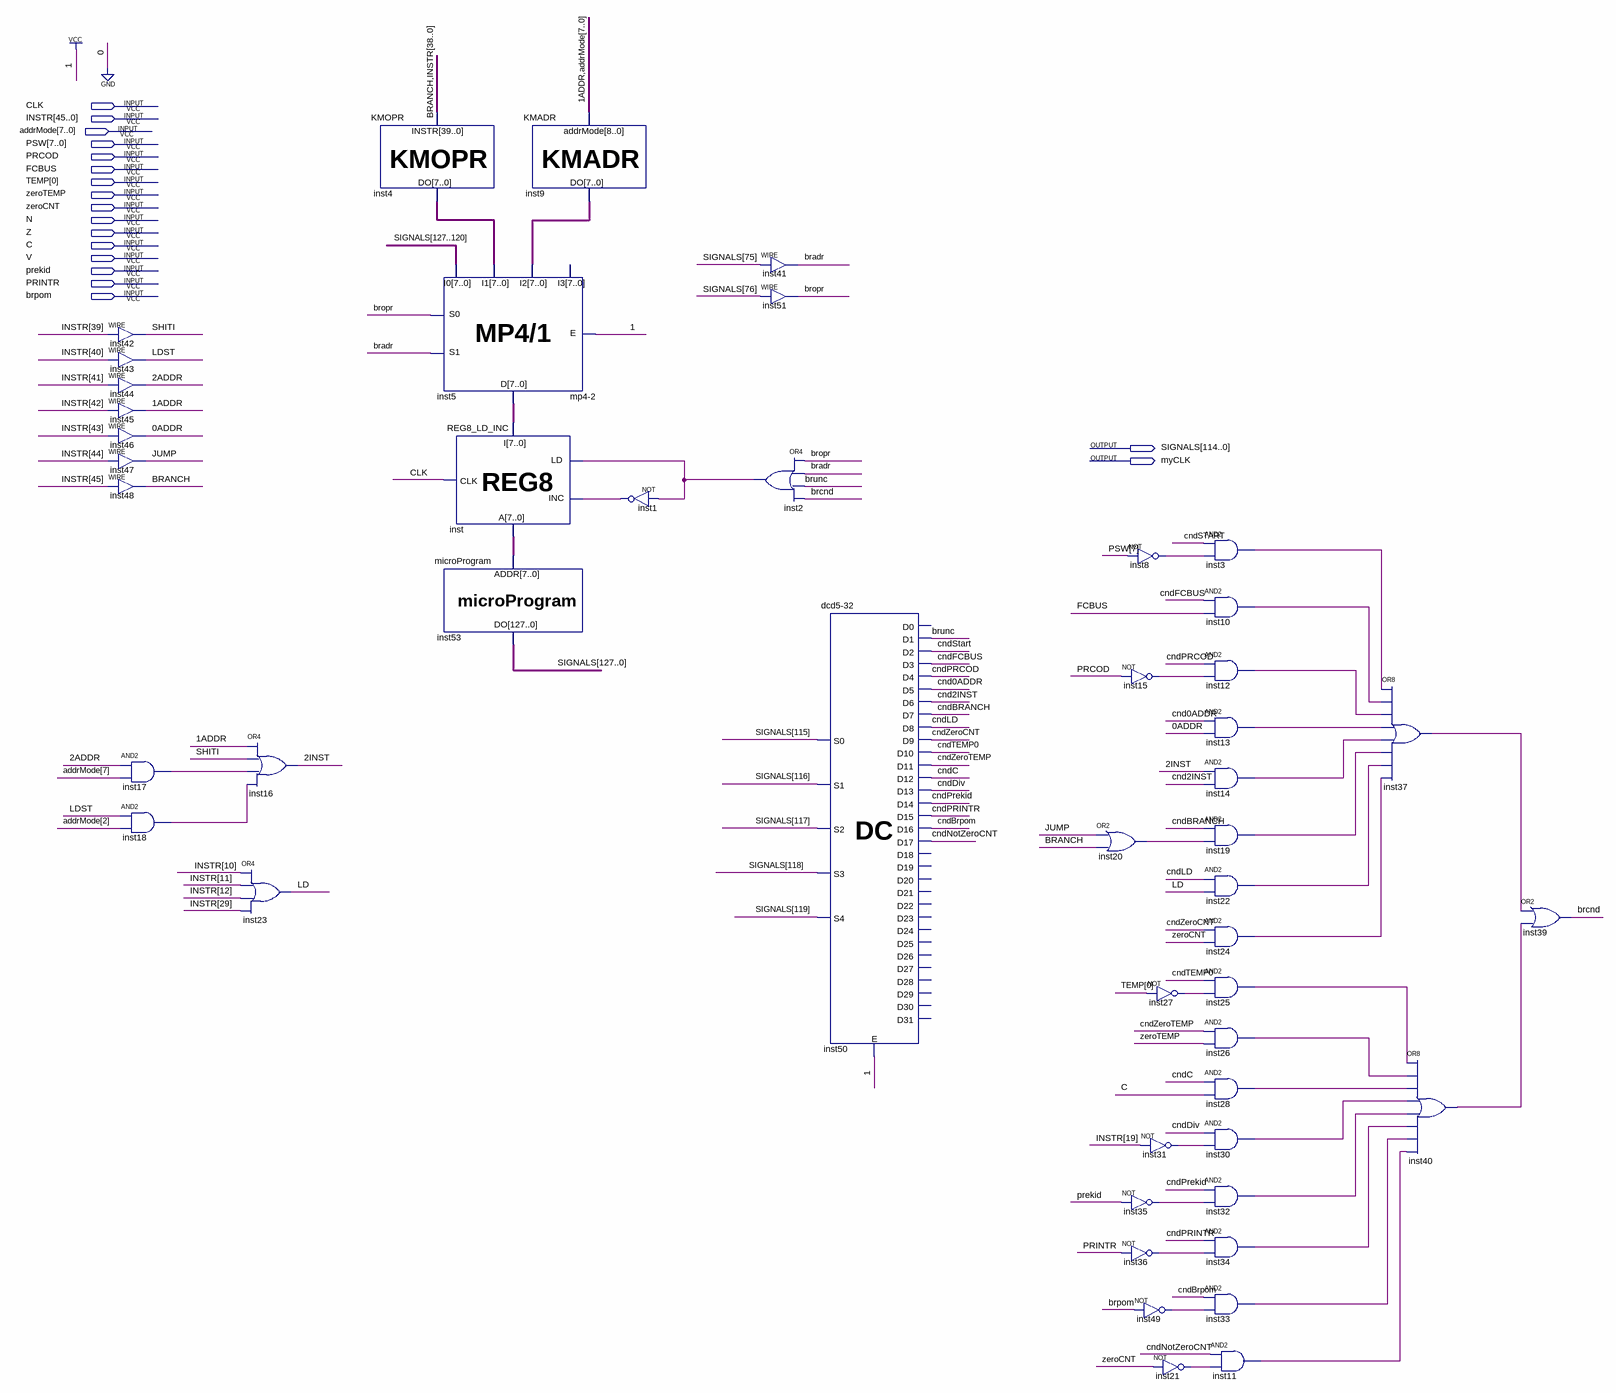
[diagram p0: schematic sheet]
// Quartus schematic Control_unit.bdf as structural Verilog: 49 symbols, 18 pins
module Control_unit (
  input  CLK,
  input  [45:0] INSTR,
  input  [7:0] addrMode,
  input  [7:0] PSW,
  input  PRCOD,
  input  FCBUS,
  input  [0:0] TEMP,
  input  zeroTEMP,
  input  zeroCNT,
  input  N,
  input  Z,
  input  C,
  input  V,
  input  prekid,
  input  PRINTR,
  input  brpom,
  output [127:0] SIGNALS,
  output myCLK
);

  wire \0ADDR , \1ADDR , \2ADDR , \2INST , bradr, BRANCH, brcnd, bropr, brunc, cnd0ADDR, cnd2INST, cndBRANCH,
       cndBrpom, cndC, cndDiv, cndFCBUS, cndLD, cndNotZeroCNT, cndPRCOD, cndPrekid, cndPRINTR, cndSTART,
       cndTEMP0, cndZeroCNT, cndZeroTEMP, inst1_out, inst2_out, inst3_out, inst8_out, inst10_out, inst11_out,
       inst12_out, inst13_out, inst14_out, inst15_out, inst17_out, inst18_out, inst19_out, inst20_out,
       inst21_out, inst22_out, inst24_out, inst25_out, inst26_out, inst27_out, inst28_out, inst30_out,
       inst31_out, inst32_out, inst33_out, inst34_out, inst35_out, inst36_out, inst37_out, inst40_out,
       inst49_out, JUMP, LD, LDST, SHITI;
  wire [7:0] inst4_do, inst5_d, inst9_do, inst_a;

  assign SHITI = INSTR[39];  // WIRE inst42
  assign LDST = INSTR[40];  // WIRE inst43
  assign \2ADDR  = INSTR[41];  // WIRE inst44
  assign \1ADDR  = INSTR[42];  // WIRE inst45
  assign \0ADDR  = INSTR[43];  // WIRE inst46
  assign JUMP = INSTR[44];  // WIRE inst47
  assign BRANCH = INSTR[45];  // WIRE inst48
  and inst17 (inst17_out, \2ADDR , addrMode[7]);
  and inst18 (inst18_out, LDST, addrMode[2]);
  or inst16 (\2INST , \1ADDR , SHITI, inst17_out, inst18_out);
  or inst23 (LD, INSTR[10], INSTR[11], INSTR[12], INSTR[29]);
  KMOPR inst4 (.INSTR({BRANCH, INSTR[38:0]}), .DO(inst4_do));
  \mp4-2  inst5 (
    .E(1'b1), .S0(bropr), .S1(bradr), .I0(SIGNALS[127:120]), .I1(inst4_do), .I2(inst9_do), .D(inst5_d));  // open: I3
  microProgram inst53 (.ADDR(inst_a), .DO(SIGNALS));
  REG8_LD_INC inst (.CLK(CLK), .I(inst5_d), .INC(inst1_out), .LD(inst2_out), .A(inst_a));
  KMADR inst9 (.addrMode({\1ADDR , addrMode}), .DO(inst9_do));
  not inst1 (inst1_out, inst2_out);
  assign bradr = SIGNALS[75];  // WIRE inst41
  assign bropr = SIGNALS[76];  // WIRE inst51
  or inst2 (inst2_out, bropr, bradr, brunc, brcnd);
  \dcd5-32  inst50 (
    .E(1'b1), .S0(SIGNALS[115]), .S1(SIGNALS[116]), .S2(SIGNALS[117]), .S3(SIGNALS[118]), .S4(SIGNALS[119]),
    .D1(brunc), .D2(cndSTART), .D3(cndFCBUS), .D4(cndPRCOD), .D5(cnd0ADDR), .D6(cnd2INST), .D7(cndBRANCH),
    .D8(cndLD), .D9(cndZeroCNT), .D10(cndTEMP0), .D11(cndZeroTEMP), .D12(cndC), .D13(cndDiv),
    .D14(cndPrekid), .D15(cndPRINTR), .D16(cndBrpom), .D17(cndNotZeroCNT));  // open: D0, D18, D19, D20, D21, D22, D23, D24, D25, D26, D27, D28, D29, D30, D31
  not inst8 (inst8_out, PSW[7]);
  not inst15 (inst15_out, PRCOD);
  or inst20 (inst20_out, JUMP, BRANCH);
  not inst31 (inst31_out, INSTR[19]);
  not inst35 (inst35_out, prekid);
  not inst36 (inst36_out, PRINTR);
  not inst49 (inst49_out, brpom);
  not inst27 (inst27_out, TEMP[0]);
  not inst21 (inst21_out, zeroCNT);
  and inst3 (inst3_out, cndSTART, inst8_out);
  and inst10 (inst10_out, cndFCBUS, FCBUS);
  and inst12 (inst12_out, cndPRCOD, inst15_out);
  and inst13 (inst13_out, cnd0ADDR, \0ADDR );
  and inst14 (inst14_out, \2INST , cnd2INST);
  and inst19 (inst19_out, cndBRANCH, inst20_out);
  and inst22 (inst22_out, cndLD, LD);
  and inst24 (inst24_out, cndZeroCNT, zeroCNT);
  and inst25 (inst25_out, cndTEMP0, inst27_out);
  and inst26 (inst26_out, cndZeroTEMP, zeroTEMP);
  and inst28 (inst28_out, cndC, C);
  and inst30 (inst30_out, cndDiv, inst31_out);
  and inst32 (inst32_out, cndPrekid, inst35_out);
  and inst34 (inst34_out, cndPRINTR, inst36_out);
  and inst33 (inst33_out, cndBrpom, inst49_out);
  and inst11 (inst11_out, cndNotZeroCNT, inst21_out);
  or inst37 (inst37_out, inst3_out, inst10_out, inst12_out, inst13_out, inst14_out, inst19_out, inst22_out, inst24_out);
  or inst40 (inst40_out, inst25_out, inst26_out, inst28_out, inst30_out, inst32_out, inst34_out, inst33_out, inst11_out);
  or inst39 (brcnd, inst37_out, inst40_out);
endmodule
